# Altium schematic sheet gsu25.SchDoc
size A; SheetNumber: 10; SheetTotal: 17
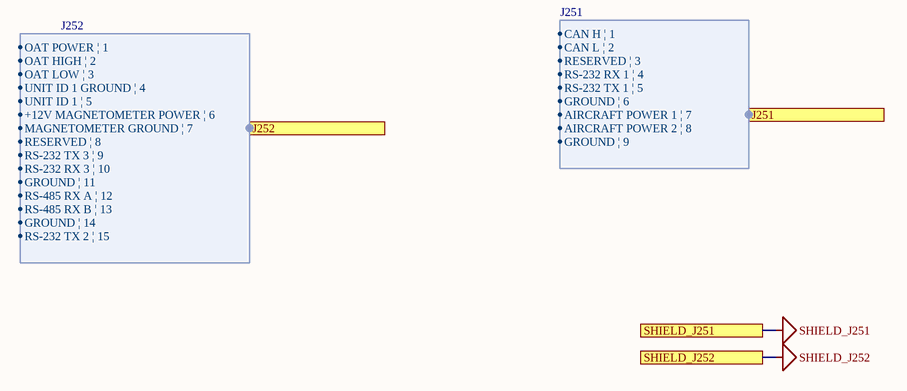
[diagram p0: gsu25.SchDoc]

## Ports
J251 (harness J251), J252 (harness J252), SHIELD_J251, SHIELD_J252

## Harnesses
J251: CAN H | 1, CAN L | 2, RESERVED | 3, RS-232 RX 1 | 4, RS-232 TX 1 | 5, GROUND | 6, AIRCRAFT POWER 1 | 7, AIRCRAFT POWER 2 | 8, GROUND | 9
J252: OAT POWER | 1, OAT HIGH | 2, OAT LOW | 3, UNIT ID 1 GROUND | 4, UNIT ID 1 | 5, +12V MAGNETOMETER POWER | 6, MAGNETOMETER GROUND | 7, RESERVED | 8, RS-232 TX 3 | 9, RS-232 RX 3 | 10, GROUND | 11, RS-485 RX A | 12, RS-485 RX B | 13, GROUND | 14, RS-232 TX 2 | 15

## Nets
SHIELD_J251: port SHIELD_J251
SHIELD_J252: port SHIELD_J252